# EasyEDA schematic MySen_raspiGateway_EasyEDA_Schematic.json
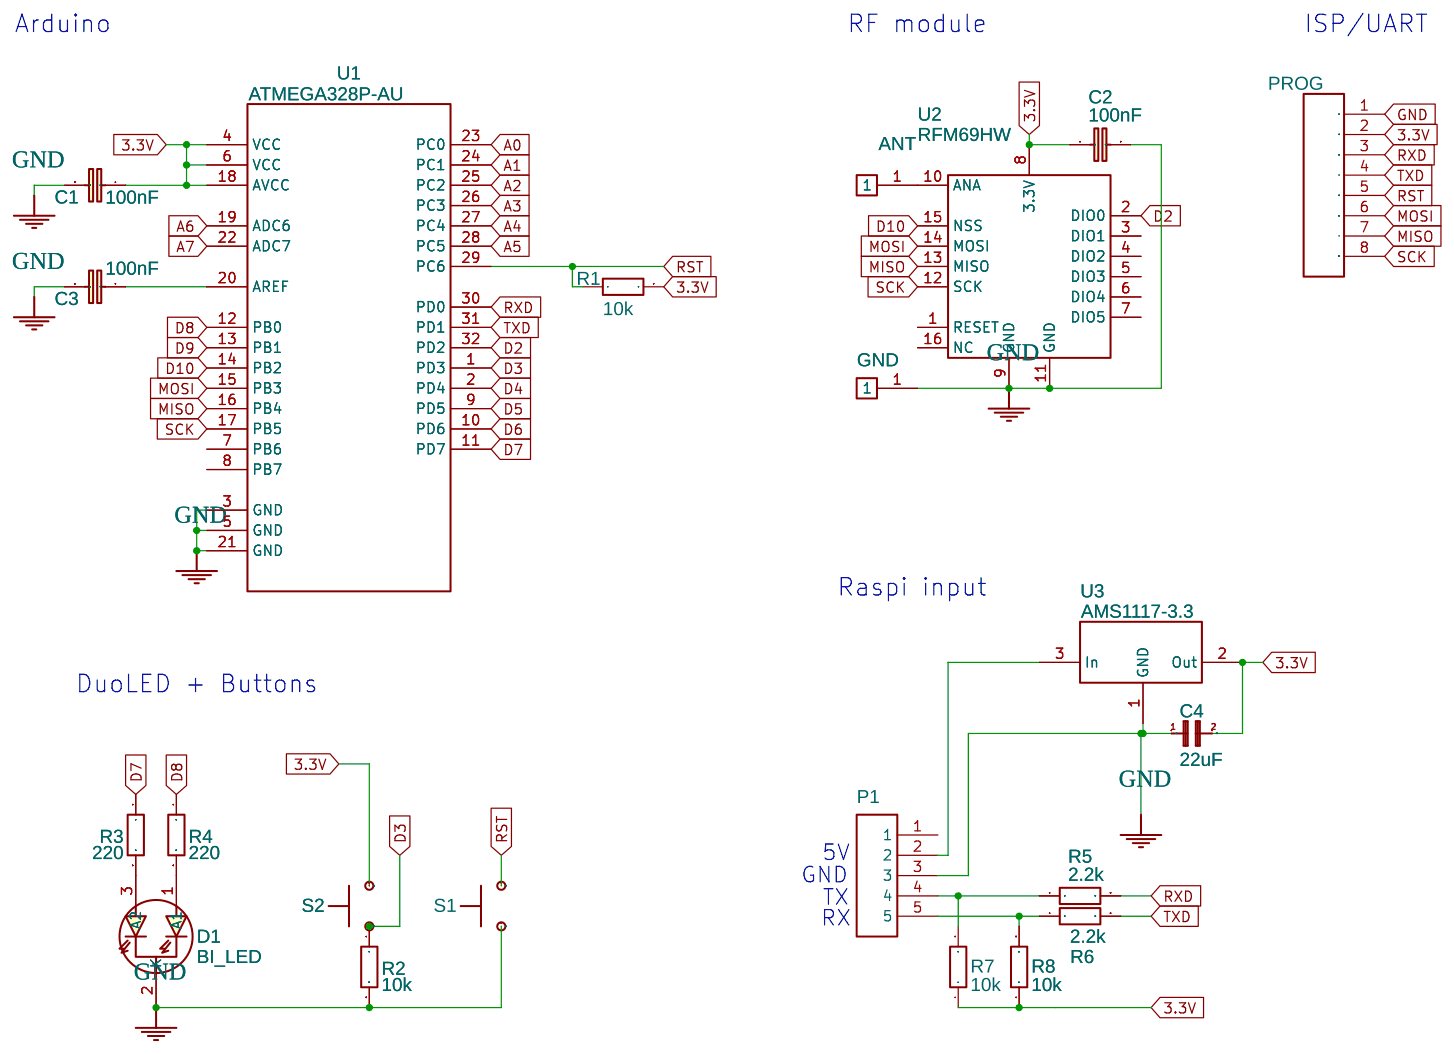
[diagram p0: schematic sheet]

## Parts
ANT  1-S-PAD  [ANT_PAD]
C1  100nF  [C1206]
C2  100nF  [C1206]
C3  100nF  [C1206]
C4  22uF  [6032]
D1  BI_LED  [DUO-LED]
GND  1-S-PAD  [ANT_PAD]
P1  1x5 Header  [1X5 HEADER]
PROG  Header 2pin  [JST_1.25MM_8P_HAND]
R1  10k  [1206]
R2  10k  [1206]
R3  220  [1206]
R4  220  [1206]
R5  2.2k  [1206]
R6  2.2k  [1206]
R7  10k  [1206]
R8  10k  [1206]
S1  Momentary Switch Open  [TACTILE-PTH]
S2  Momentary Switch Open  [TACTILE-PTH]
U1  ATMEGA328P-AU  [TQFP-32_7X7X08P]
U2  RFM69HW  [RFM69HW]
U3  AMS1117-3.3  [SOT-223]

## Library data of the parts
ANT GND = -: Contributor: cuiier
C1-C3 = -: Non-Polarized capacitor in various packages; catid: 20; Contributor: DangerousPrototype; Manufacturer Part: ?
C4 U2 = -: catid: 20; Manufacturer Part: ?
D1 = -: catid: 20; Contributor: KiCad; Manufacturer Part: ?
P1 = -: Contributor: iinnovations; Manufacturer Part: ?
PROG = -: Contributor: jhonfvg; sourceId: 27DxrJ1Vd; Manufacturer Part: ?
R1-R8 = -: Power: 1/4W; Tolerance: ±5%; Supplier: LCSC; Manufacturer: UniOhm; Manufacturer Part: 1206 J000T5E; LCSC: C19290
U1 = -: catid: 20; Supplier: LCSC; Manufacturer: ATMEL; LCSC: C14877
U3 = -: sourceId: dwIGgezVh; Supplier: LCSC; Manufacturer: AMS; LCSC: C6186; LCSC Assembly: Yes

## Nets
3.3V: C1.1 C2.1 C4.2 PROG.2 R1.2 R7.1 R8.1 S2.3(2) U1.4(VCC) U1.6(VCC) U1.18(AVCC) U2.8(3.3V) U3.2(Out)
GND: C1.2 C2.2 C3.2 C4.1 D1.2(K) GND.1 P1.3 PROG.1 R2.2 S1.1 U1.3(GND) U1.5(GND) U1.21(GND) U2.9(GND) U2.11(GND) U3.1(GND)
A0: U1.23(PC0)
A1: U1.24(PC1)
A2: U1.25(PC2)
A3: U1.26(PC3)
A4: U1.27(PC4)
A5: U1.28(PC5)
A6: U1.19(ADC6)
A7: U1.22(ADC7)
D2: U1.32(PD2) U2.2(DIO0)
D3: R2.1 S2.1 U1.1(PD3)
D4: U1.2(PD4)
D5: U1.9(PD5)
D6: U1.10(PD6)
D7: R3.1 U1.11(PD7)
D8: R4.1 U1.12(PB0)
D9: U1.13(PB1)
D10: U1.14(PB2) U2.15(NSS)
MISO: PROG.7 U1.16(PB4) U2.13(MISO)
MOSI: PROG.6 U1.15(PB3) U2.14(MOSI)
RST: PROG.5 R1.1 S1.3(2) U1.29(PC6)
RXD: PROG.3 R5.2 U1.30(PD0)
SCK: PROG.8 U1.17(PB5) U2.12(SCK)
TXD: PROG.4 R6.2 U1.31(PD1)
ANT_1: ANT.1 U2.10(ANA)
D1_1: D1.1(A1) R4.2
D1_3: D1.3(A2) R3.2
P1_2: P1.2 U3.3(In)
P1_4: P1.4 R5.1 R7.2
P1_5: P1.5 R6.1 R8.2
U1_20: C3.1 U1.20(AREF)

Not connected (* = marked no-connect by the designer): P1 1; U1 7(PB6) 8(PB7); U2 1(RESET) 3(DIO1) 4(DIO2) 5(DIO3) 6(DIO4) 7(DIO5) 16(NC)

## Notes on the sheet
- Arduino
- RF module
- ISP/UART
- Raspi input
- DuoLED + Buttons
- 5V
- GND
- TX
- RX
